# EAGLE design schematic1 (EAGLE 9.6.2)

## Sheet 1 of 4: Intelligence
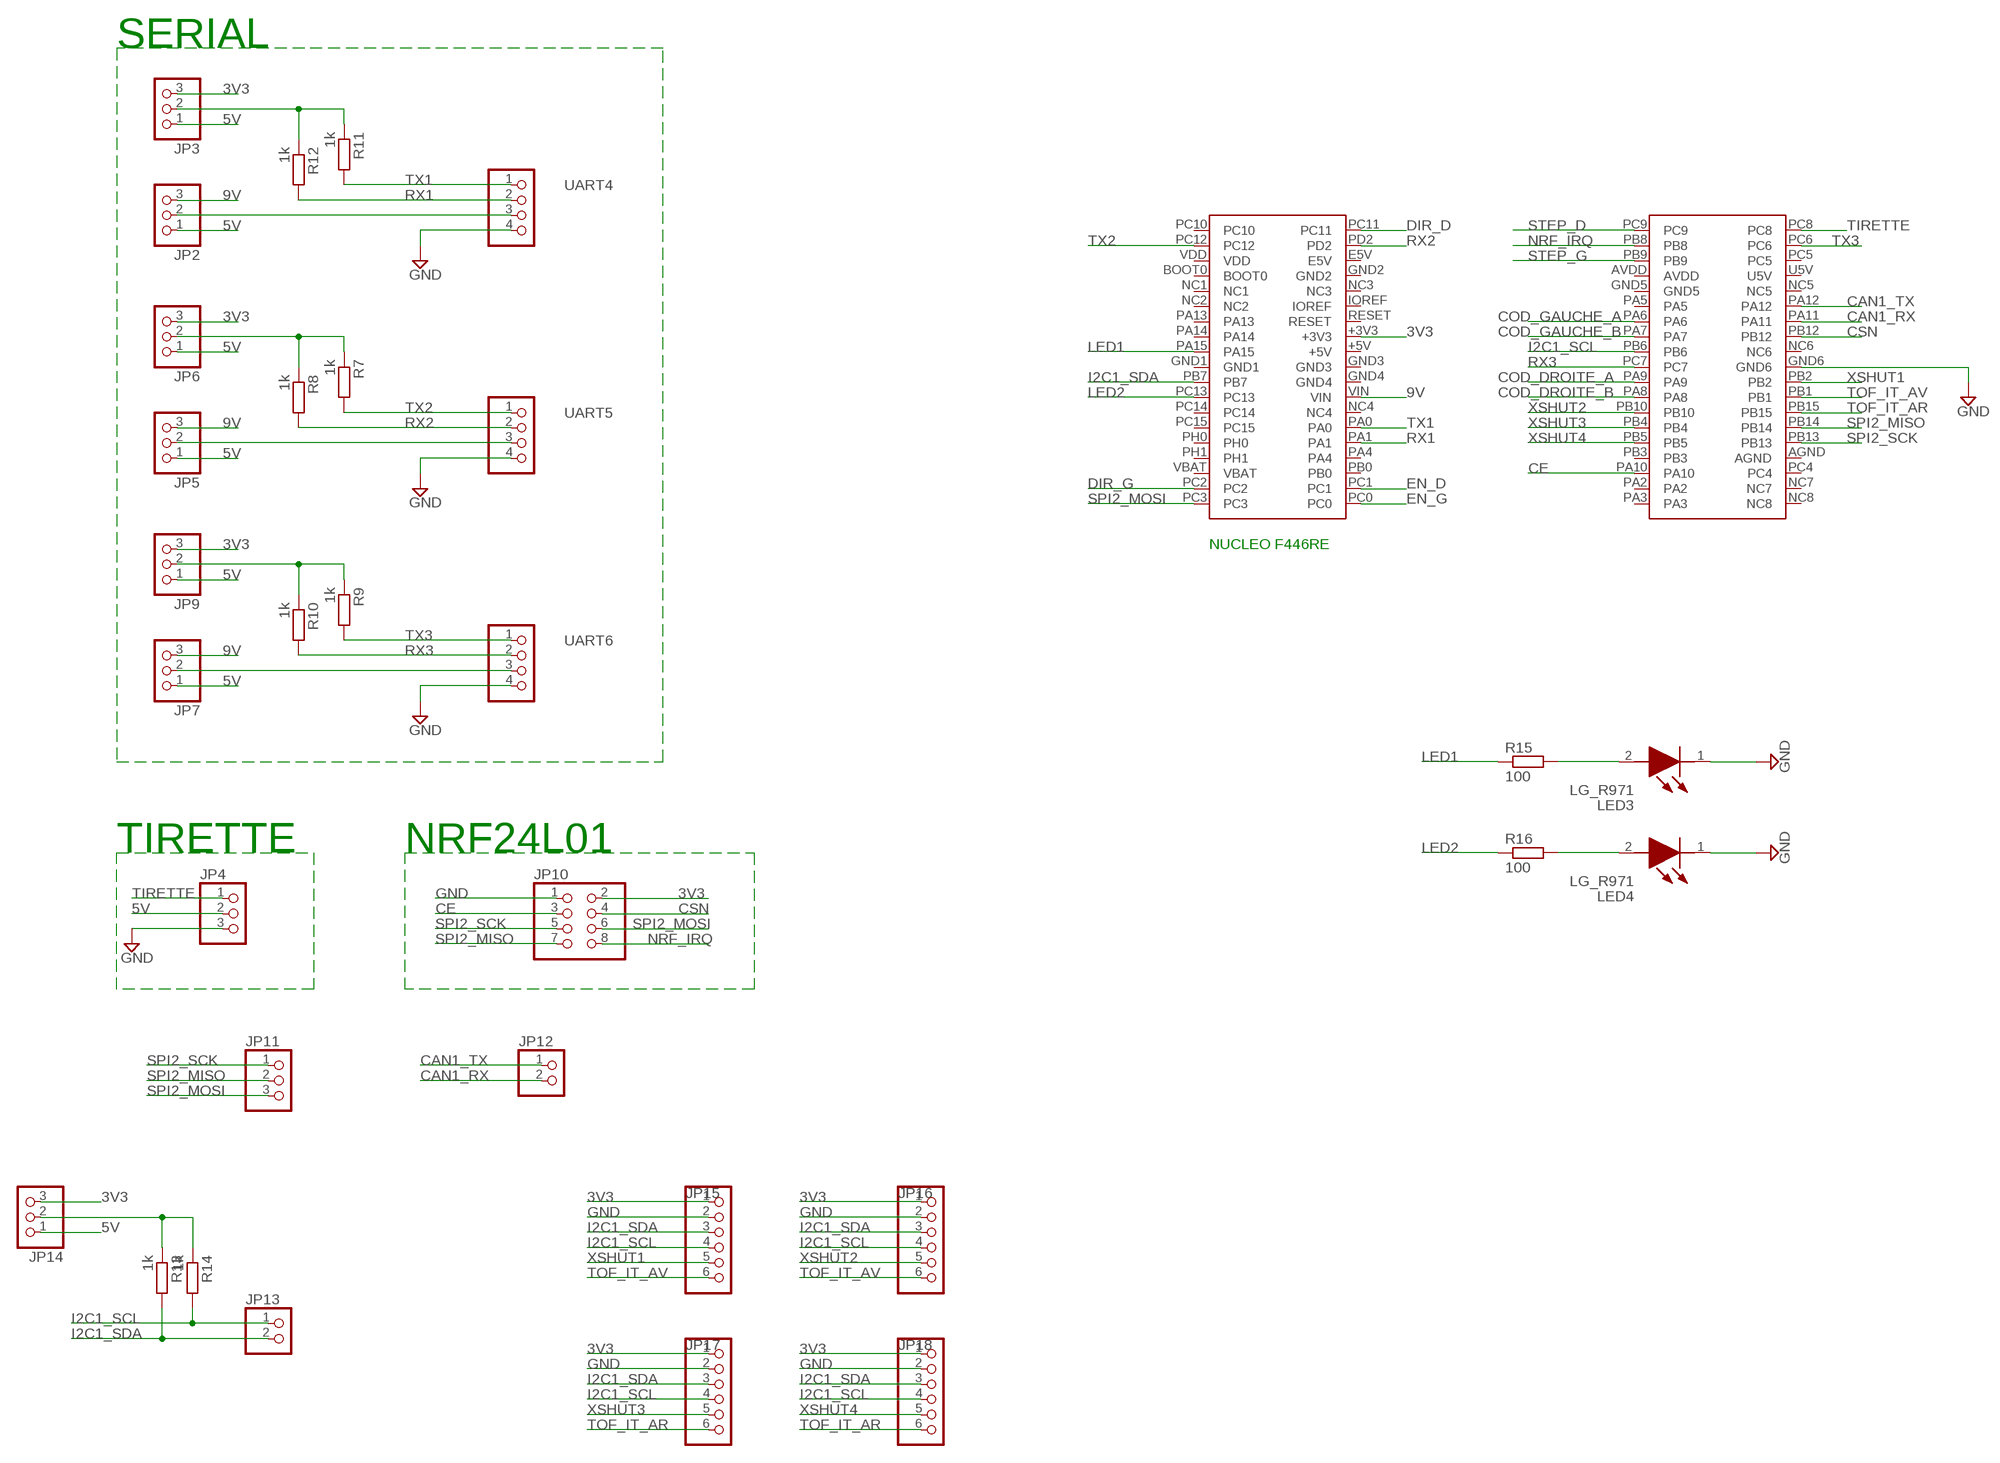
[diagram p0: schematic, sheet 1]

### Parts
JP2  PINHD-1X3  [1X03]
JP3  PINHD-1X3  [1X03]
JP4  PINHD-1X3  [1X03]
JP5  PINHD-1X3  [1X03]
JP6  PINHD-1X3  [1X03]
JP7  PINHD-1X3  [1X03]
JP9  PINHD-1X3  [1X03]
JP10  PINHD-2X4  [2X04]
JP11  PINHD-1X3  [1X03]
JP12  PINHD-1X2  [1X02]
JP13  PINHD-1X2  [1X02]
JP14  PINHD-1X3  [1X03]
JP15  PINHD-1X6  [1X06]
JP16  PINHD-1X6  [1X06]
JP17  PINHD-1X6  [1X06]
JP18  PINHD-1X6  [1X06]
LED3  LG_R971  [LEDC2012X90N]
LED4  LG_R971  [LEDC2012X90N]
R7  1k  R-EU_R0805  [R0805]
R8  1k  R-EU_R0805  [R0805]
R9  1k  R-EU_R0805  [R0805]
R10  1k  R-EU_R0805  [R0805]
R11  1k  R-EU_R0805  [R0805]
R12  1k  R-EU_R0805  [R0805]
R13  1k  R-EU_R0805  [R0805]
R14  1k  R-EU_R0805  [R0805]
R15  100  R-EU_R0805  [R0805]
R16  100  R-EU_R0805  [R0805]
U$1  NUCLEO_F446RE  [MB1136]
UART4  PINHD-1X4  [1X04]
UART5  PINHD-1X4  [1X04]
UART6  PINHD-1X4  [1X04]

### Nets
3V3: JP3.3 JP6.3 JP9.3 JP10.2 JP14.3 JP15.1 JP16.1 JP17.1 JP18.1 U$1.+3V3
5V: JP2.1 JP3.1 JP4.2 JP5.1 JP6.1 JP7.1 JP9.1 JP14.1 ; also sheet 2,3,4
9V: JP2.3 JP5.3 JP7.3 U$1.VIN ; also sheet 4
CAN1_RX: JP12.2 U$1.PA11
CAN1_TX: JP12.1 U$1.PA12
CE: JP10.3 U$1.PA10
COD_DROITE_A: U$1.PA9 ; also sheet 3
COD_DROITE_B: U$1.PA8 ; also sheet 3
COD_GAUCHE_A: U$1.PA6 ; also sheet 3
COD_GAUCHE_B: U$1.PA7 ; also sheet 3
CSN: JP10.4 U$1.PB12
DIR_D: U$1.PC11 ; also sheet 2
DIR_G: U$1.PC2 ; also sheet 2
EN_D: U$1.PC1 ; also sheet 2
EN_G: U$1.PC0 ; also sheet 2
GND: JP4.3 JP10.1 JP15.2 JP16.2 JP17.2 JP18.2 LED3.1(K) LED4.1(K) U$1.GND6 UART4.4 UART5.4 UART6.4 ; also sheet 2,3,4
I2C1_SCL: JP13.1 JP15.4 JP16.4 JP17.4 JP18.4 R14.2 U$1.PB6
I2C1_SDA: JP13.2 JP15.3 JP16.3 JP17.3 JP18.3 R13.2 U$1.PB7
LED1: R15.1 U$1.PA15
LED2: R16.1 U$1.PC13
N$3: JP3.2 R11.1 R12.1
N$4: JP6.2 R7.1 R8.1
N$10: JP9.2 R9.1 R10.1
N$14: LED3.2(A) R15.2
N$16: JP14.2 R13.1 R14.1
N$17: LED4.2(A) R16.2
NRF_IRQ: JP10.8 U$1.PB8
RX1: R12.2 U$1.PA1 UART4.2
RX2: R8.2 U$1.PD2 UART5.2
RX3: R10.2 U$1.PC7 UART6.2
SPI2_MISO: JP10.7 JP11.2 U$1.PB14
SPI2_MOSI: JP10.6 JP11.3 U$1.PC3
SPI2_SCK: JP10.5 JP11.1 U$1.PB13
STEP_D: U$1.PC9 ; also sheet 2
STEP_G: U$1.PB9 ; also sheet 2
TIRETTE: JP4.1 U$1.PC8
TOF_IT_AR: JP17.6 JP18.6 U$1.PB15
TOF_IT_AV: JP15.6 JP16.6 U$1.PB1
TX1: R11.2 U$1.PA0 UART4.1
TX2: R7.2 U$1.PC12 UART5.1
TX3: R9.2 U$1.PC6 UART6.1
VIN: JP2.2 UART4.3
VIN1: JP5.2 UART5.3
VIN2: JP7.2 UART6.3
XSHUT1: JP15.5 U$1.PB2
XSHUT2: JP16.5 U$1.PB10
XSHUT3: JP17.5 U$1.PB4
XSHUT4: JP18.5 U$1.PB5
Unconnected: U$1.+5V U$1.AGND U$1.AVDD U$1.BOOT0 U$1.E5V U$1.GND1 U$1.GND2 U$1.GND3 U$1.GND4 U$1.GND5 U$1.IOREF U$1.NC1 U$1.NC2 U$1.NC3 U$1.NC4 U$1.NC5 U$1.NC6 U$1.NC7 U$1.NC8 U$1.PA2 U$1.PA3 U$1.PA4 U$1.PA5 U$1.PA13 U$1.PA14 U$1.PB0 U$1.PB3 U$1.PC4 U$1.PC5 U$1.PC10 U$1.PC14 U$1.PC15 U$1.PH0 U$1.PH1 U$1.RESET U$1.U5V U$1.VBAT U$1.VDD

### Notes on the sheet
- SERIAL
- NUCLEO F446RE
- TIRETTE | NRF24L01

## Sheet 2 of 4: Motorisation
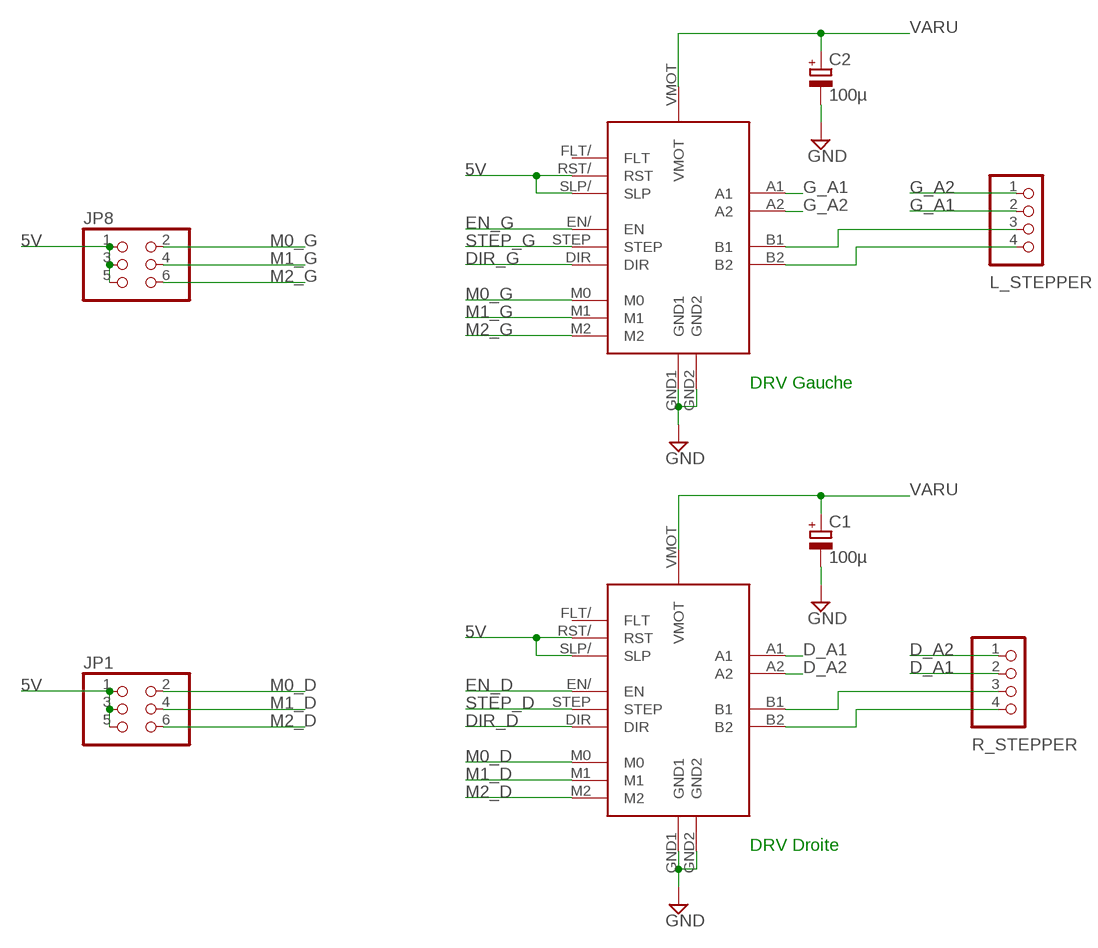
[diagram p1: schematic, sheet 2]

### Parts
C1  100µ  CPOL-EUE5-6  [E5-6]
C2  100µ  CPOL-EUE5-6  [E5-6]
JP1  PINHD-2X3  [2X03]
JP8  PINHD-2X3  [2X03]
L_STEPPER  PINHD-1X4  [1X04]
R_STEPPER  PINHD-1X4  [1X04]
U$2  POLOLU_DRV8825  [POLOLU_DRV8825]
U$3  POLOLU_DRV8825  [POLOLU_DRV8825]

### Nets
5V: JP1.1 JP1.3 JP1.5 JP8.1 JP8.3 JP8.5 U$2.RST/(RST) U$2.SLP/(SLP) U$3.RST/(RST) U$3.SLP/(SLP) ; also sheet 1,3,4
D_A1: R_STEPPER.2 U$3.A1
D_A2: R_STEPPER.1 U$3.A2
DIR_D: U$3.DIR ; also sheet 1
DIR_G: U$2.DIR ; also sheet 1
EN_D: U$3.EN/(EN) ; also sheet 1
EN_G: U$2.EN/(EN) ; also sheet 1
G_A1: L_STEPPER.2 U$2.A1
G_A2: L_STEPPER.1 U$2.A2
GND: C1.- C2.- U$2.GND1 U$2.GND2 U$3.GND1 U$3.GND2 ; also sheet 1,3,4
M0_D: JP1.2 U$3.M0
M0_G: JP8.2 U$2.M0
M1_D: JP1.4 U$3.M1
M1_G: JP8.4 U$2.M1
M2_D: JP1.6 U$3.M2
M2_G: JP8.6 U$2.M2
N$6: L_STEPPER.3 U$2.B1
N$7: L_STEPPER.4 U$2.B2
N$8: R_STEPPER.3 U$3.B1
N$9: R_STEPPER.4 U$3.B2
STEP_D: U$3.STEP ; also sheet 1
STEP_G: U$2.STEP ; also sheet 1
VARU: C1.+ C2.+ U$2.VMOT U$3.VMOT ; also sheet 4
Unconnected: U$2.FLT/(FLT) U$3.FLT/(FLT)

### Notes on the sheet
- DRV Gauche
- DRV Droite

## Sheet 3 of 4: ODOMETRIE
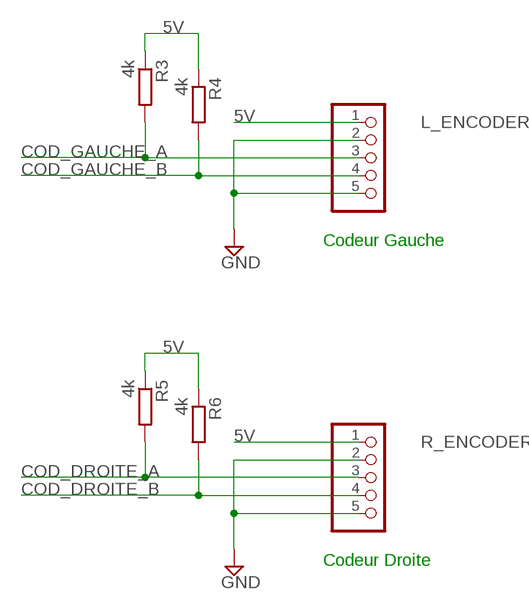
[diagram p2: schematic, sheet 3]

### Parts
L_ENCODER  PINHD-1X5  [1X05]
R3  4k  R-EU_R0805  [R0805]
R4  4k  R-EU_R0805  [R0805]
R5  4k  R-EU_R0805  [R0805]
R6  4k  R-EU_R0805  [R0805]
R_ENCODER  PINHD-1X5  [1X05]

### Nets
5V: L_ENCODER.1 R3.1 R4.1 R5.1 R6.1 R_ENCODER.1 ; also sheet 1,2,4
COD_DROITE_A: R5.2 R_ENCODER.3 ; also sheet 1
COD_DROITE_B: R6.2 R_ENCODER.4 ; also sheet 1
COD_GAUCHE_A: L_ENCODER.3 R3.2 ; also sheet 1
COD_GAUCHE_B: L_ENCODER.4 R4.2 ; also sheet 1
GND: L_ENCODER.2 L_ENCODER.5 R_ENCODER.2 R_ENCODER.5 ; also sheet 1,2,4

### Notes on the sheet
- Codeur Gauche
- Codeur Droite

## Sheet 4 of 4: ALIMENTATION
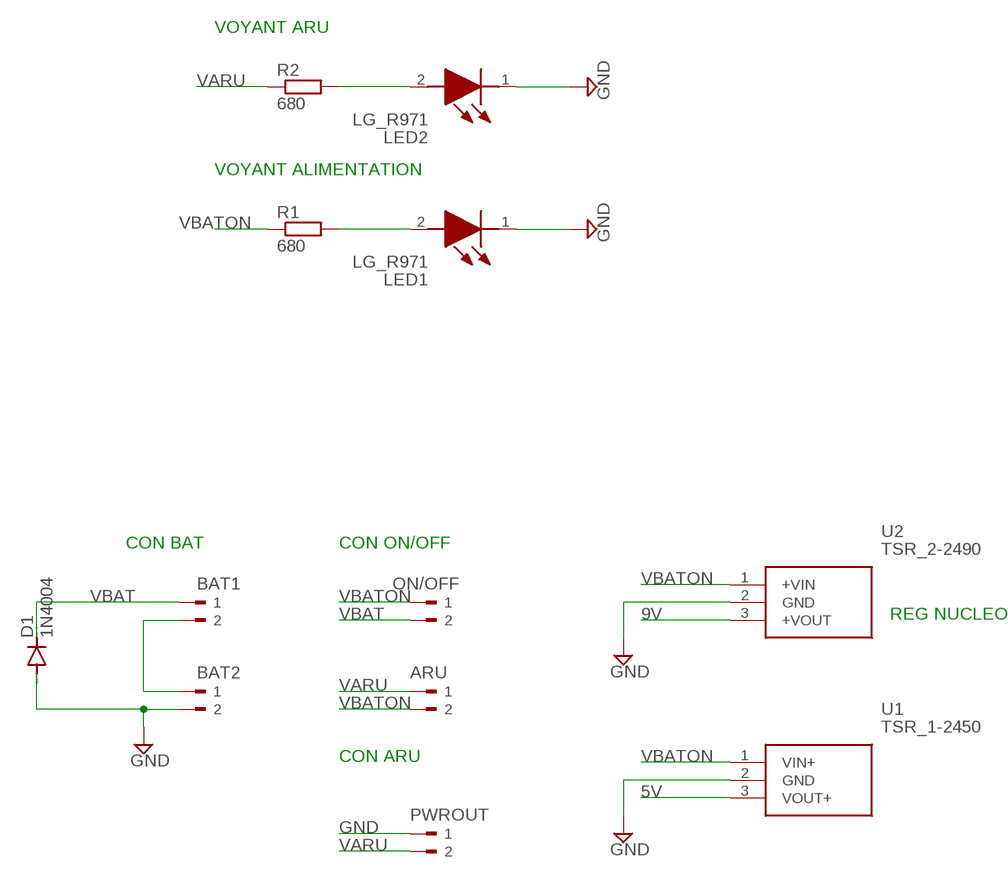
[diagram p3: schematic, sheet 4]

### Parts
ARU  180G-2  [180G-2]
BAT1  180G-2  [180G-2]
BAT2  180G-2  [180G-2]
D1  1N4004  [DO41-10]
LED1  LG_R971  [LEDC2012X90N]
LED2  LG_R971  [LEDC2012X90N]
ON/OFF  180G-2  [180G-2]
PWROUT  180G-2  [180G-2]
R1  680  R-EU_R0805  [R0805]
R2  680  R-EU_R0805  [R0805]
U1  TSR_1-2450  [TSR-1-24120]
U2  TSR_2-2490  [TSR_2-24XX]

### Nets
5V: U1.3(VOUT+) ; also sheet 1,2,3
9V: U2.3(+VOUT) ; also sheet 1
GND: BAT2.2 D1.A LED1.1(K) LED2.1(K) PWROUT.1 U1.2(GND) U2.2(GND) ; also sheet 1,2,3
N$1: LED1.2(A) R1.2
N$2: LED2.2(A) R2.2
N$5: BAT1.2 BAT2.1
VARU: ARU.1 PWROUT.2 R2.1 ; also sheet 2
VBAT: BAT1.1 D1.C ON/OFF.2
VBATON: ARU.2 ON/OFF.1 R1.1 U1.1(VIN+) U2.1(+VIN)

### Notes on the sheet
- VOYANT ARU
- VOYANT ALIMENTATION
- CON BAT | CON ON/OFF
- REG NUCLEO
- CON ARU

## Library data of the parts
ARU BAT1 BAT2 ON/OFF PWROUT = con-weidmueller-sl35:180G-2: WEIDMUELLER CLAMP CONNECTOR; OC_FARNELL: unknown; OC_NEWARK: unknown
C1 C2 = rcl:CPOL-EU: POLARIZED CAPACITOR, European symbol; SPICEPREFIX: C
D1 = diode:1N4004: DIODE general purpose rectifier, 1 A
JP1 JP8 = pinhead_modif:PINHD-2X3: PIN HEADER
JP2-JP7 JP9 JP11 JP14 = pinhead:PINHD-1X3: PIN HEADER
JP10 = pinhead:PINHD-2X4: PIN HEADER
JP12 JP13 = pinhead:PINHD-1X2: PIN HEADER
JP15-JP18 = pinhead:PINHD-1X6: PIN HEADER
L_ENCODER R_ENCODER = pinhead:PINHD-1X5: PIN HEADER
L_STEPPER R_STEPPER UART4-UART6 = pinhead:PINHD-1X4: PIN HEADER
LED1-LED4 = SamacSys_Parts:LG_R971: Green 0805 CHIPLED LG R971 Osram Opto CHIPLED 0805 Series Green LED 160 ?? 0805 Source: Datasheet <http://uk.rs-online.com/web/p/products/6545773P>; ALLIED_NUMBER: 70338572; DESCRIPTION: Green 0805 CHIPLED LG R971 Osram Opto CHIPLED 0805 Series Green LED 160 ?? 0805; HEIGHT: 0.9mm; MANUFACTURER_NAME: OSRAM; MANUFACTURER_PART_NUMBER: LG R971; RS_PART_NUMBER: 6545773P; RS_PRICE-STOCK: http://uk.rs-online.com/web/p/products/6545773P
R1-R16 = rcl:R-EU_: RESISTOR, European symbol; SPICEPREFIX: R
U1 = SamacSys_Parts:TSR_1-2450: 1 Amp POL switching regulator, 4.6 to -36 VDC input, pos.-pos. circuit, LM78 compatible, SIP-3 Source: Datasheet <http://uk.rs-online.com/web/p/products/6664379P>; DESCRIPTION: 1 Amp POL switching regulator, 4.6 to -36 VDC input, pos.-pos. circuit, LM78 compatible, SIP-3; HEIGHT: mm; MANUFACTURER_NAME: Traco Power; MANUFACTURER_PART_NUMBER: TSR 1-2450; RS_PART_NUMBER: 6664379P; RS_PRICE-STOCK: http://uk.rs-online.com/web/p/products/6664379P
U2 = Traco_Power:TSR_2-2490: Non-Isolated DC/DC Converters 12-36Vin 9V 2A SIP switching regulator Source: Datasheet <https://assets.tracopower.com/20180409093301/TSR2/documents/tsr2-datasheet.pdf>; DESCRIPTION: Non-Isolated DC/DC Converters 12-36Vin 9V 2A SIP switching regulator; HEIGHT: 10.6mm; MANUFACTURER_NAME: Traco Power; MANUFACTURER_PART_NUMBER: TSR 2-2490; MOUSER_PART_NUMBER: 495-TSR2-2490; MOUSER_PRICE-STOCK: https://www.mouser.co.uk/ProductDetail/TRACO-Power/TSR-2-2490?qs=NtE2QagKf6T%2F%252B4cKUWVBJQ%3D%3D
U$1 = NUCLEO_boards:NUCLEO_F446RE
U$2 U$3 = Pololu:POLOLU_DRV8825

## Board
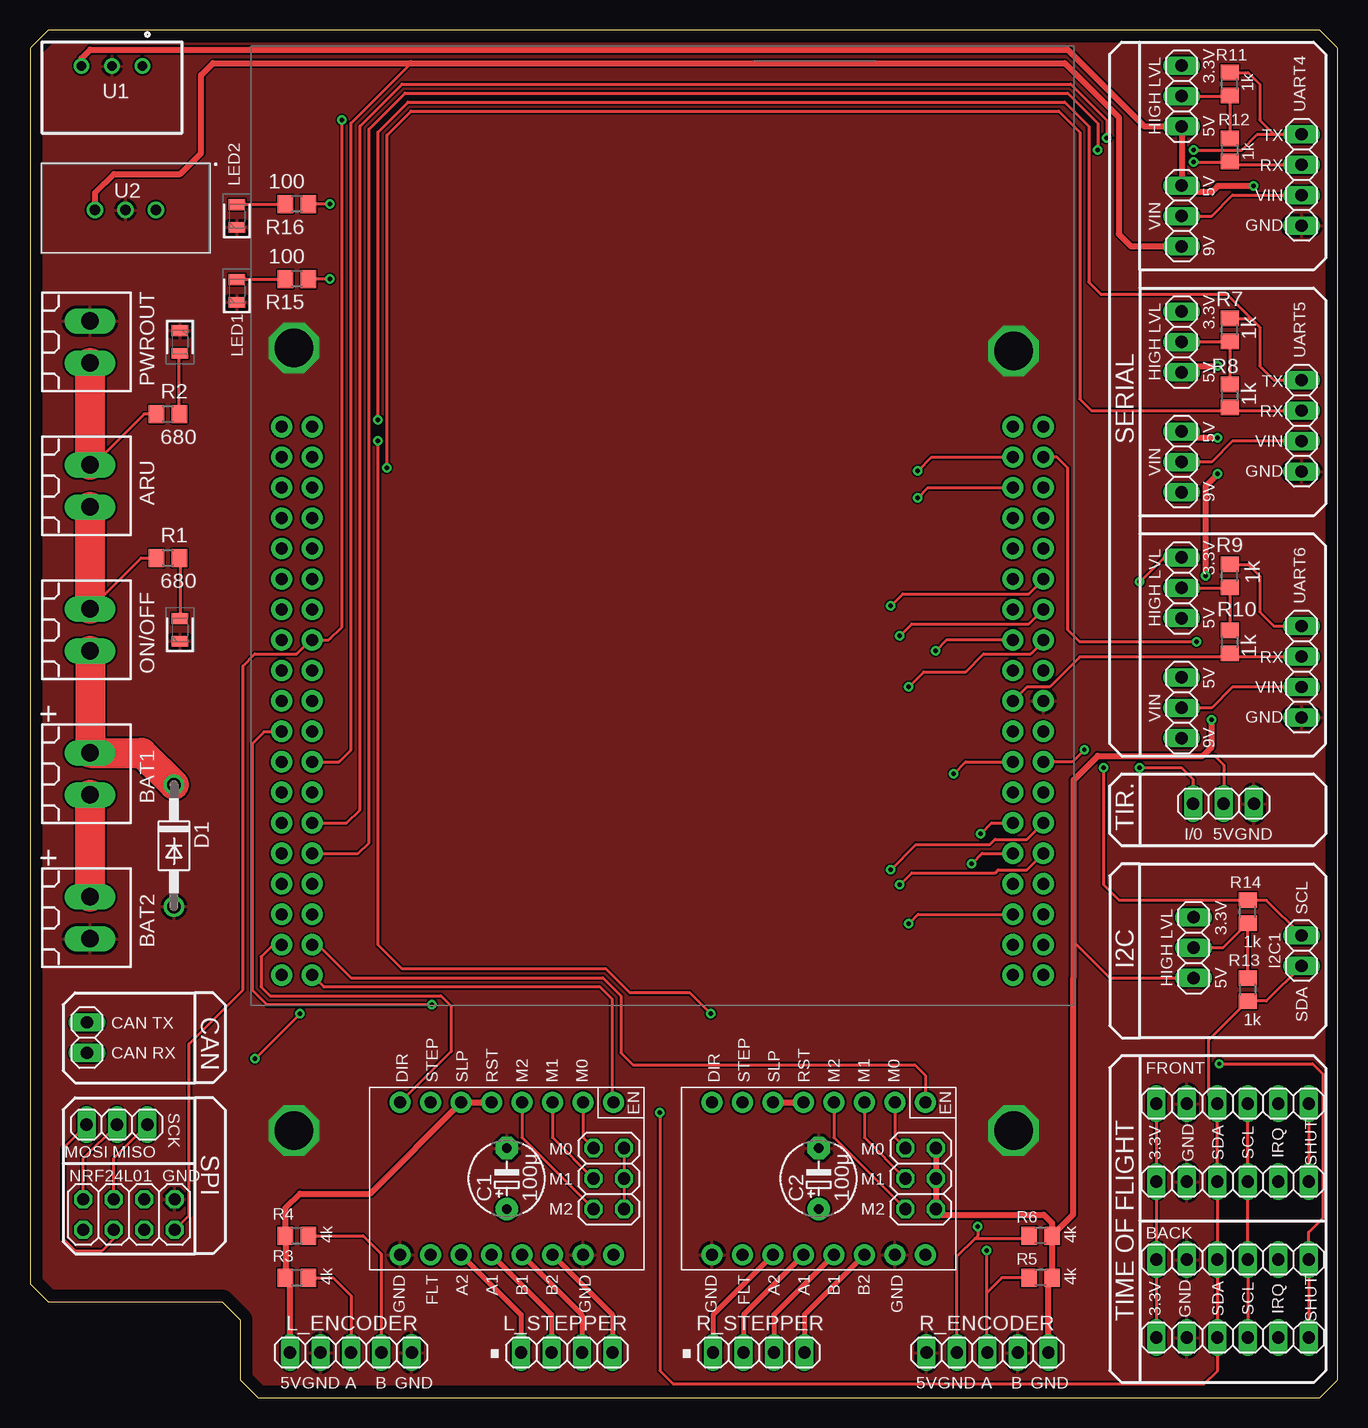
[diagram p4: board, top side]
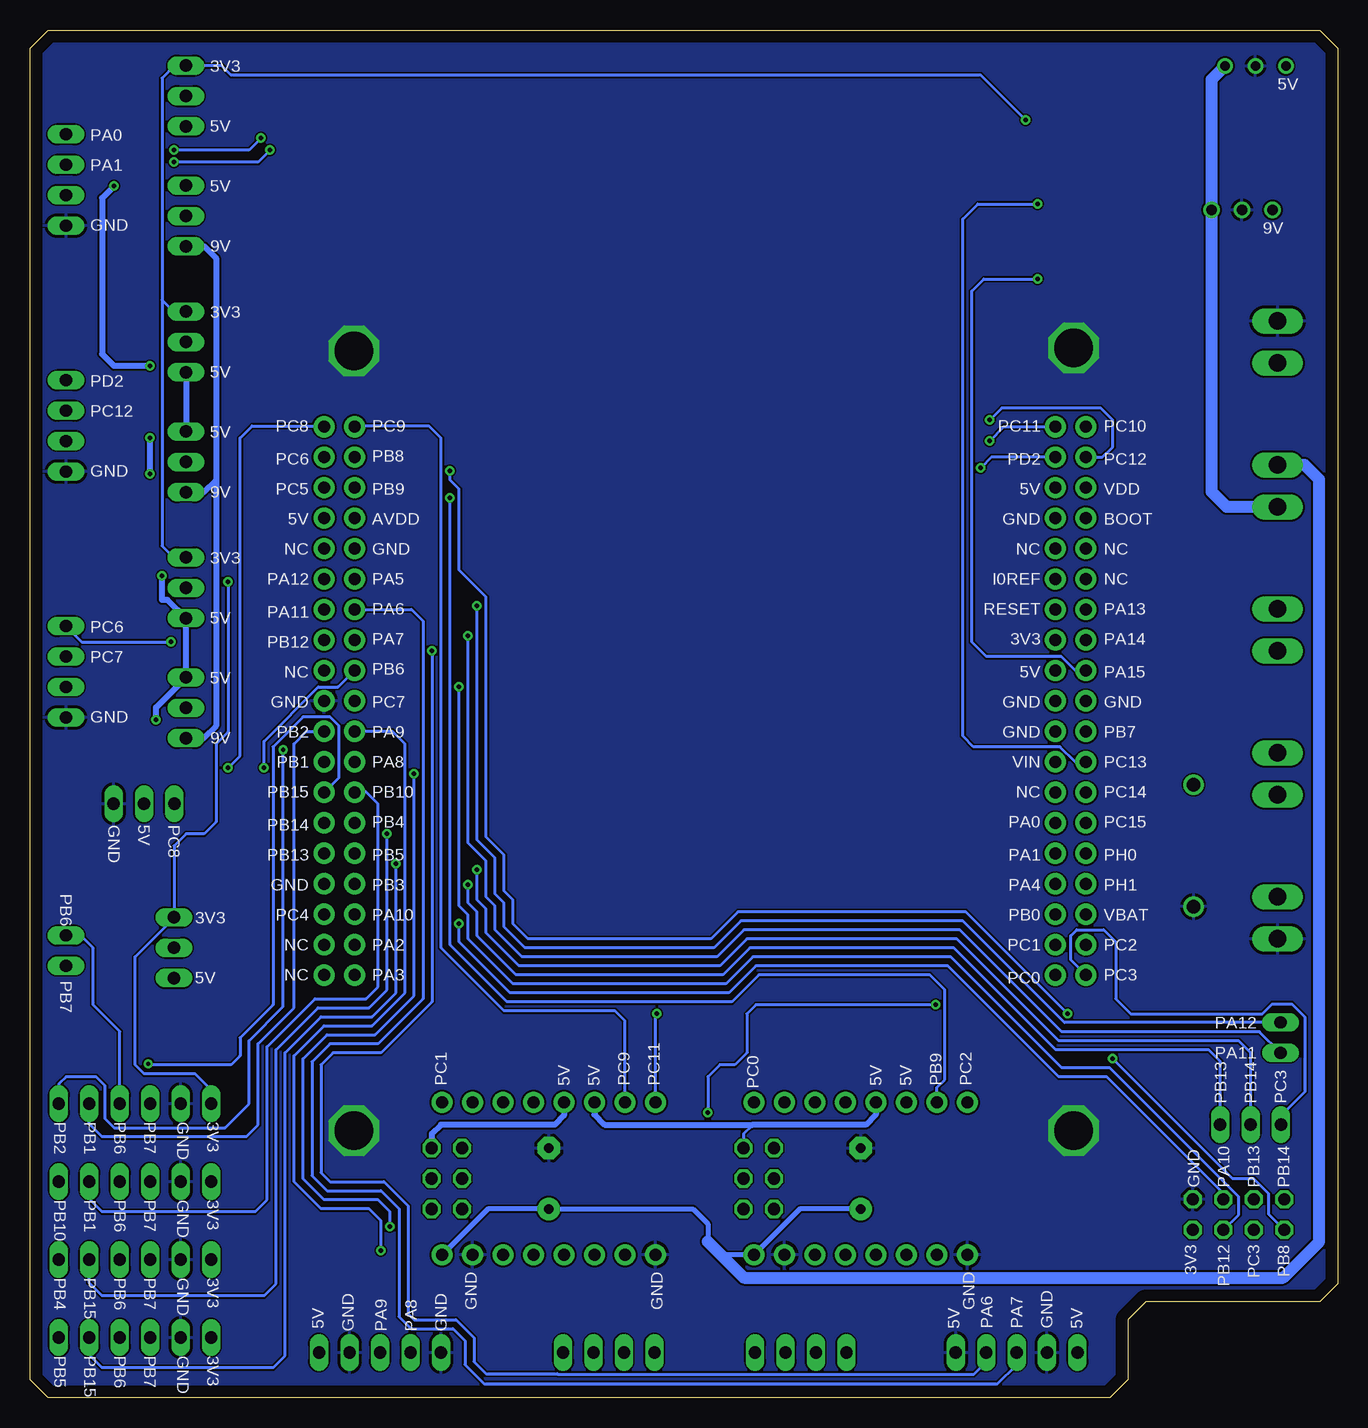
[diagram p5: board, bottom side, seen from below]

Size 109 x 114 mm. Coordinates in mm from the lower left corner, seen from the top.
Outline: 1.5,8 16,8 17.5,6.5 17.5,1.5 19,0 107.5,0 109,1.5 109,112.5 107.5,114 1.5,114 0,112.5 0,9.5 1.5,8
Copper layers (1*16): Top 0.035mm / dielectric 1.5mm / Bottom 0.035mm
Design rules "default": minimum track width 6mil, minimum drill 0.35mm, track to track 6mil, track to pad 6mil, pad to pad 6mil, via to via 6mil, smd to smd 6mil, copper to edge 40mil, drill to drill 6mil, minimum pad ring 10mil, minimum via ring 8mil, stop-mask expansion 4mil, vias tented up to drill 0mil, thermal gap 10mil

### Footprints (pad centres in the part's own frame; a part is rotated, then mirrored left to right if it is on the bottom)
180G-2 = drill 1.422 long: 1 -1.75,0; 2 1.75,0
E5-6 = drill 0.813 pad 1.905: + -2.54,0 | drill 0.813 pad 1.905 octagon: - 2.54,0
DO41-10 = drill 1.118: A 5.08,0; C -5.08,0
2X03 = drill 1.016 octagon: 1 -2.54,-1.27; 2 -2.54,1.27; 3 0,-1.27; 4 0,1.27; 5 2.54,-1.27; 6 2.54,1.27
1X03 = drill 1.016 long: 1 -2.54,0; 2 0,0; 3 2.54,0
2X04 = drill 1.016 octagon: 1 -3.81,-1.27; 2 -3.81,1.27; 3 -1.27,-1.27; 4 -1.27,1.27; 5 1.27,-1.27; 6 1.27,1.27; 7 3.81,-1.27; 8 3.81,1.27
1X02 = drill 1.016 long: 1 -1.27,0; 2 1.27,0
1X06 = drill 1.016 long: 1 -6.35,0; 2 -3.81,0; 3 -1.27,0; 4 1.27,0; 5 3.81,0; 6 6.35,0
1X05 = drill 1.016 long: 1 -5.08,0; 2 -2.54,0; 3 0,0; 4 2.54,0; 5 5.08,0
1X04 = drill 1.016 long: 1 -3.81,0; 2 -1.27,0; 3 1.27,0; 4 3.81,0
LEDC2012X90N = smd 0.9 x 1.4: 1 -0.95,0; 2 0.95,0
R0805 = smd 1.3 x 1.5: 1 -0.95,0; 2 0.95,0
TSR-1-24120 = drill 0.78 pad 1.28: 1 -2.54,0; 2 0,0; 3 2.54,0
TSR_2-24XX = drill 0.85 pad 1.381: 1 0,0; 2 2.54,0; 3 5.08,0
MB1136 = drill 1 pad 1.778: +3V3 -30.48,-6.35; +5V -30.48,-8.89; AGND 30.48,-26.67; AVDD 27.94,3.81; BOOT0 -33.02,3.81; E5V -30.48,6.35; GND1 -33.02,-11.43; GND2 -30.48,3.81; GND3 -30.48,-11.43; GND4 -30.48,-13.97; GND5 27.94,1.27; GND6 30.48,-11.43; IOREF -30.48,-1.27; NC1 -33.02,1.27; NC2 -33.02,-1.27; NC3 -30.48,1.27; NC4 -30.48,-19.05; NC5 30.48,1.27; NC6 30.48,-8.89; NC7 30.48,-31.75; NC8 30.48,-34.29; PA0 -30.48,-21.59; PA1 -30.48,-24.13; PA2 27.94,-31.75; PA3 27.94,-34.29; PA4 -30.48,-26.67; PA5 27.94,-1.27; PA6 27.94,-3.81; PA7 27.94,-6.35; PA8 27.94,-16.51; PA9 27.94,-13.97; PA10 27.94,-29.21; PA11 30.48,-3.81; PA12 30.48,-1.27; PA13 -33.02,-3.81; PA14 -33.02,-6.35; PA15 -33.02,-8.89; PB0 -30.48,-29.21; PB1 30.48,-16.51; PB2 30.48,-13.97; PB3 27.94,-26.67; PB4 27.94,-21.59; PB5 27.94,-24.13; PB6 27.94,-8.89; PB7 -33.02,-13.97; PB8 27.94,8.89; PB9 27.94,6.35; PB10 27.94,-19.05; PB12 30.48,-6.35; PB13 30.48,-24.13; PB14 30.48,-21.59; PB15 30.48,-19.05; PC0 -30.48,-34.29; PC1 -30.48,-31.75; PC2 -33.02,-31.75; PC3 -33.02,-34.29; PC4 30.48,-29.21; PC5 30.48,6.35; PC6 30.48,8.89; PC7 27.94,-11.43; PC8 30.48,11.43; PC9 27.94,11.43; PC10 -33.02,11.43; PC11 -30.48,11.43; PC12 -33.02,8.89; PC13 -33.02,-16.51; PC14 -33.02,-19.05; PC15 -33.02,-21.59; PD2 -30.48,8.89; PH0 -33.02,-24.13; PH1 -33.02,-26.67; RESET -30.48,-3.81; U5V 30.48,3.81; VBAT -33.02,-29.21; VDD -33.02,6.35; VIN -30.48,-16.51
POLOLU_DRV8825 = drill 1 pad 1.778: A1 6.35,-1.27; A2 6.35,-3.81; B1 6.35,1.27; B2 6.35,3.81; DIR -6.35,-8.89; EN/ -6.35,8.89; FLT/ 6.35,-6.35; GND1 6.35,6.35; GND2 6.35,-8.89; M0 -6.35,6.35; M1 -6.35,3.81; M2 -6.35,1.27; RST/ -6.35,-1.27; SLP/ -6.35,-3.81; STEP -6.35,-6.35; VMOT 6.35,8.89

### Placement (x,y rotation side)
ARU  5,76 270 top
BAT1  5,52 270 top
BAT2  5,40 270 top
C1  39.75,18.25 90 top
C2  65.75,18.25 90 top
D1  12,46 270 top
JP1  74.25,18.25 270 bottom
JP2  96,98.5 270 top
JP3  96,108.5 90 top
JP4  99.5,49.5 0 top
JP5  96,78 270 top
JP6  96,88 90 top
JP7  96,57.5 270 top
JP8  48.25,18.25 270 bottom
JP9  96,67.5 90 top
JP10  8.25,15.25 180 top
JP11  7.25,22.75 180 top
JP12  4.75,30 270 top
JP13  106,37.25 270 top
JP14  97,37.5 90 top
JP15  100.25,24.5 0 top
JP16  100.25,18 0 top
JP17  100.25,11.5 0 top
JP18  100.25,5 0 top
L_ENCODER  26.75,3.75 0 top
L_STEPPER  44.75,3.75 0 top
LED1  12.5,64 90 top
LED2  12.5,88 270 top
LED3  17.25,92.25 90 top
LED4  17.25,98.5 90 top
ON/OFF  5,64 270 top
PWROUT  5,88 270 top
R1  11.5,70 0 top
R2  11.5,82 0 top
R3  22.25,10 0 top
R4  22.25,13.5 0 top
R5  84.25,10 180 top
R6  84.25,13.5 180 top
R7  100,89 90 top
R8  100,83.5 270 top
R9  100,68.5 90 top
R10  100,63 270 top
R11  100,109.5 90 top
R12  100,104 270 top
R13  101.5,34 270 top
R14  101.5,40.5 90 top
R15  22.25,93.25 180 top
R16  22.25,99.5 180 top
R_ENCODER  79.82,3.75 180 top
R_STEPPER  60.75,3.75 0 top
U1  6.84,111 180 top
U2  10.5,99 180 top
U$1  54,69.5 0 top
U$2  39.75,18.25 270 top
U$3  65.75,18.25 270 top
UART4  106,101.5 270 top
UART5  106,81 270 top
UART6  106,60.5 270 top

### Tracks (layer width: path | path; a pad name or v marks a point on that pad's centre or on a via)
3V3  (via drill 0.35)
  Top 0.25: JP15.1 JP16.1 JP17.1 JP18.1 | JP9.3 95.96,70 94.5,70 v92.5,68 | v26,106.5 26,64.25 24.9,63.15 U$1.+3V3 23.38,63.15 22.21,61.98 18.73,61.98 17.75,61 17.75,34 13.25,29.5 13.25,15.17 JP10.2
  Bottom 0.25: 98,91.5 98,110 96.96,111.04 JP3.3 93.04,111.04 92.25,110.25 29.75,110.25 v26,106.5 | 98,91.5 98,71 97,70 96.04,70 JP9.3 | JP6.3 97.04,90.54 98,91.5 | v92.5,68 92.5,55.5 93.5,54.5 93.5,48 94.5,47 96,47 97,46 JP14.3 97,40 100.25,36.75 100.25,27.75 99.5,27 95.25,27 93.9,25.65 JP15.1
5V  (via drill 0.35)
  Top 0.25: JP8.1 JP8.3 JP8.5 | R3.1 21.3,10.25 21.67,9.88 | R5.1 85.2,10.25 84.9,9.95 | 97.75,53.5 98.75,53.5 99.5,52.75 JP4.2 | 87,38 90.04,34.96 JP14.1
  Top 0.508: U$2.RST/ U$2.SLP/ 28.34,17 22.5,17 21.3,15.8 R4.1 21.3,10.25 | U$3.SLP/ U$3.RST/ | JP1.1 JP1.3 JP1.5 75.98,15.25 84.5,15.25 85.2,14.55 R6.1 | v98,68.5 98,76 v99,77 | v99,80 96.54,80 JP5.1 | JP6.1 96.54,86 v99,86 | v102,101 99,101 98.5,100.5 96.54,100.5 JP2.1 JP3.1 92.9,105.96 86.5,112.36 5,112.36 4.3,111.66 U1.3 | L_ENCODER.1 21.67,9.88 | R6.1 85.2,10.25 | R_ENCODER.1 84.9,9.95 | R6.1 86.95,15.25 86.95,34.95 87,35 87,38 87,51.5 89,53.5 97.75,53.5 98.5,54.25 v98.5,56.5
  Bottom 0.25: 48.75,22.75 49.52,21.98 JP8.1
  Bottom 0.508: U$2.RST/ 38.48,23.6 39.33,22.75 48.75,22.75 61.09,22.75 61.94,23.6 U$3.SLP/ | U$3.RST/ 64.48,23.52 65.25,22.75 74.75,22.75 75.52,21.98 JP1.1 | JP6.1 JP5.1 | v98,68.5 98,66.5 97.54,66.5 JP9.1 JP7.1 98.5,57.54 v98.5,56.5 | v99,77 v99,80 | v99,86 102,86 103,87 103,100 v102,101
9V
  Top 0.25: U$1.VIN 25.77,52.99 26.75,53.97 26.75,106.25 31.75,111.25
  Top 0.5: U2.3 5.42,100.42 7,102 12.5,102 14.25,103.75 14.25,110.25 15.25,111.25 31.75,111.25 86.25,111.25 90.75,106.75 90.75,97 91.79,95.96 JP2.3
  Bottom 0.25: 94.54,75.46 JP5.3 | 94.54,54.96 JP7.3
  Bottom 0.508: JP2.3 94.46,95.96 93.5,95 93.5,76.5 | 93.5,76.5 94.54,75.46 | 93.5,76.5 93.5,56 94.54,54.96
CAN1_RX  (via drill 0.35)
  Top 0.25: v72.5,63.5 73.5,64.5 83.25,64.5 84.44,65.69 U$1.PA11
  Bottom 0.25: JP12.2 6.52,30.5 23,30.5 31.5,39 49.5,39 51.75,36.75 68,36.75 70.25,39 70.25,41 71,41.75 71,44.75 72.5,46.25 v72.5,63.5
CAN1_TX  (via drill 0.35)
  Top 0.25: v71.75,66 72.75,67 83.25,67 U$1.PA12
  Bottom 0.25: JP12.1 22.77,31.27 31.25,39.75 49.75,39.75 52,37.5 67.75,37.5 69.5,39.25 69.5,41.25 70.25,42 70.25,45 71.75,46.5 v71.75,66
CE  (via drill 0.35)
  Top 0.25: v73.25,39.5 74.04,40.29 U$1.PA10
  Bottom 0.25: JP10.3 9.52,17.02 19.25,26.75 23.25,26.75 32.5,36 48.5,36 50.75,33.75 69,33.75 73.25,38 v73.25,39.5
COD_DROITE_A  (via drill 0.35)
  Top 0.25: 79.75,8.75 81,10 R5.2 | 79.75,8.75 79.75,3.82 R_ENCODER.3 | 79.75,8.75 v79.75,12.25
  Bottom 0.25: v79.75,12.25 79.75,14.75 80.75,15.75 84.75,15.75 87,18 87,28.5 84.5,31 80.5,31 77.75,33.75 77.75,54.5 78.78,55.53 U$1.PA9
COD_DROITE_B  (via drill 0.35)
  Top 0.25: R_ENCODER.4 77.28,11.78 78.75,13.25 | 78.75,13.25 83.05,13.25 R6.2 | v79,14.25 79,13.5 78.75,13.25 | U$1.PA8 77.99,52.99 v77,52
  Bottom 0.25: v77,52 77,33.5 80.25,30.25 84.25,30.25 86.25,28.25 86.25,18.25 84.5,16.5 80,16.5 79,15.5 v79,14.25
COD_GAUCHE_A
  Top 0.25: R3.2 25.25,10 26.75,8.5 L_ENCODER.3
  Bottom 0.25: U$1.PA6 77.19,65.69 76.25,64.75 76.25,33.25 80,29.5 84,29.5 85.5,28 85.5,18.5 84.25,17.25 79.75,17.25 78.25,15.75 78.25,6.75 77.25,5.75 73.75,5.75 72.75,4.75 72.75,2.75 71.14,1.14 28.36,1.14 26.75,2.75 L_ENCODER.3
COD_GAUCHE_B  (via drill 0.35)
  Top 0.25: R4.2 27.75,13.5 29.29,11.96 L_ENCODER.4 | U$1.PA7 76.4,63.15 v75.5,62.25
  Bottom 0.25: v75.5,62.25 75.5,33 79.75,28.75 83.75,28.75 84.75,27.75 84.75,18.75 84,18 79.5,18 77.5,16 77.5,7 77,6.5 73.5,6.5 72,5 72,3 71,2 65.04,2 64.99,1.95 30.3,1.95 29.25,3 29.25,3.71 L_ENCODER.4
CSN  (via drill 0.35)
  Top 0.25: v73.25,59.25 74.5,60.5 78,60.5 79.48,61.98 83.42,61.98 84.48,63.04 U$1.PB12
  Bottom 0.25: JP10.4 8.25,15.25 8.25,16.75 19,27.5 23,27.5 32.25,36.75 48.75,36.75 51,34.5 68.75,34.5 72.5,38.25 72.5,40.25 73.25,41 v73.25,59.25
D_A1
  Top 0.406: U$3.A1 59.48,6.9 R_STEPPER.2
D_A2
  Top 0.406: U$3.A2 56.94,6.9 R_STEPPER.1
DIR_D  (via drill 0.35)
  Top 0.25: v56.75,32 55,33.75 50,33.75 48,35.75 31,35.75 29,37.75 v29,79.75
  Bottom 0.25: U$3.DIR 56.86,31.89 v56.75,32 | v29,79.75 27.82,80.93 U$1.PC11
DIR_G
  Top 0.25: U$1.PC2 20.25,37.75 19.25,36.75 19.25,34.25 20,33.5 34.25,33.5 35.11,32.64 35.11,28.85 U$2.DIR
EN_D
  Top 0.25: U$1.PC1 24,37.75 26.75,35 47.75,35 49.25,33.5 49.25,28.75 50.25,27.75 73.75,27.75 74.64,26.86 U$3.EN/
EN_G
  Top 0.25: U$1.PC0 24.52,34.21 47.54,34.21 48.5,33.25 48.5,24.74 U$2.EN/
G_A1
  Top 0.406: U$2.A1 43.48,6.9 L_STEPPER.2
G_A2
  Top 0.406: U$2.A2 40.94,6.9 L_STEPPER.1
GND  (via drill 3.2)
  other vias: 22,87.5 82,87.25 22,22.25 82,22.25
  pour Top: -3,115.75 -3,-3 111.25,-3 111.25,115.75
  pour Bottom: -3.75,-4.5 -3.75,116.5 112.75,116.5 112.75,-4.5
I2C1_SCL  (via drill 0.35)
  Top 0.25: JP13.1 103.07,41.45 R14.2 90.8,41.45 89.5,42.75 v89.5,52.5 | JP18.4 JP17.4 JP16.4 JP15.4
  Bottom 0.25: JP15.4 101.52,30.52 103.75,32.75 103.75,37.5 104.77,38.52 JP13.1 | U$1.PB6 83.31,59.24 84.96,59.24 89.5,54.7 v89.5,52.5
I2C1_SDA  (via drill 0.35)
  Top 0.25: JP13.2 103.07,33.05 R13.2 98.23,29.78 98.23,25.25 JP15.3 JP16.3 JP17.3 JP18.3 99,4.98 99,2.25 97.89,1.14 53.61,1.14 52.5,2.25 v52.5,23.75 | U$1.PB7 20.95,55.5 19.5,55.5 18.5,54.5 18.5,34 19.75,32.75 v33.5,32.75
  Bottom 0.25: v33.5,32.75 48.5,32.75 49.25,32 49.25,28.75 50.25,27.75 51.5,27.75 52.5,26.75 v52.5,23.75
LED1  (via drill 0.35)
  Top 0.25: v25,93.25 R15.1
  Bottom 0.25: U$1.PA15 21.87,60.61 23.04,61.78 29.28,61.78 30.5,63 30.5,92.25 29.5,93.25 v25,93.25
LED2  (via drill 0.35)
  Top 0.25: v25,99.5 R16.1
  Bottom 0.25: U$1.PC13 21.87,52.99 23.13,54.25 30.34,54.25 31.25,55.16 31.25,98.25 30,99.5 v25,99.5
M0_D
  Top 0.25: U$3.M0 72.1,21.67 JP1.2
M0_G
  Top 0.25: U$2.M0 46.1,21.67 JP8.2
M1_D
  Top 0.25: U$3.M1 69.56,21.67 JP1.4
M1_G
  Top 0.25: U$2.M1 43.56,21.67 JP8.4
M2_D
  Top 0.25: U$3.M2 67.02,21.67 JP1.6
M2_G
  Top 0.25: U$2.M2 41.02,21.67 JP8.6
N$1
  Top 0.2: R1.2 12.5,69.95
  Top 0.25: 12.5,69.95 LED1.2
N$2
  Top 0.2: 12.45,87 LED2.2
  Top 0.25: R2.2 12.45,87
N$3
  Top 0.2: 99.95,108.5 R11.1
  Top 0.25: JP3.2 99.95,108.5 | R11.1 R12.1
N$4
  Top 0.25: JP6.2 99.95,88 R7.1 R8.1
N$5
  Top 2.5: BAT2.1 BAT1.2
N$6
  Top 0.406: U$2.B1 46.02,6.9 L_STEPPER.3
N$7
  Top 0.406: U$2.B2 48.56,6.9 L_STEPPER.4
N$8
  Top 0.406: U$3.B1 62.02,6.9 R_STEPPER.3
N$9
  Top 0.406: U$3.B2 64.56,6.9 R_STEPPER.4
N$10
  Top 0.25: JP9.2 99.95,67.5 R9.1 R10.1
N$14
  Top 0.25: R15.2 21.25,93.2 LED3.2
N$16
  Top 0.25: R13.1 R14.1 99.45,37.5 JP14.2
N$17
  Top 0.25: R16.2 21.25,99.45 LED4.2
NRF_IRQ  (via drill 0.35)
  Top 0.25: v18.75,28.25 v22.5,32 | v74,77.25 75.14,78.39 U$1.PB8
  Bottom 0.25: JP10.8 5.75,15.29 5.75,17 7,18.25 8.75,18.25 v18.75,28.25 | v22.5,32 31,40.5 50,40.5 52.25,38.25 67.5,38.25 68.75,39.5 68.75,41.5 69.5,42.25 69.5,45.25 71,46.75 71,66.75 73.25,69 73.25,75.75 74,76.5 v74,77.25
RX1  (via drill 0.35)
  Top 0.2: 100.28,102.77 100.03,103.03 R12.2
  Top 0.25: 100.28,102.77 UART4.2 | U$1.PA1 27.37,45.37 28.25,46.25 28.25,105.75 31.25,108.75 86.5,108.75 89,106.25 v89,104 | v97,103 100,103 100.03,103.03
  Bottom 0.25: v89,104 90,103 v97,103
RX2  (via drill 0.35)
  Top 0.25: R8.2 100.28,82.27 | 100.28,82.27 UART5.2 | v29.75,77.5 29.75,105.25 31.75,107.25 85.75,107.25 87.5,105.5 87.5,83.25 88.48,82.27 100.28,82.27
  Bottom 0.25: U$1.PD2 28.86,78.39 v29.75,77.5
RX3
  Top 0.25: UART6.2 100.28,61.77 R10.2 99.7,61.75 87.5,61.75 85,59.25 83.12,59.25 U$1.PC7
SPI2_MISO  (via drill 0.35)
  Top 0.25: JP10.7 4.44,19.94 JP11.2 | v71.75,44 73.84,46.09 80.02,46.09 80.46,46.54 83.11,46.54 U$1.PB14
  Bottom 0.25: JP11.2 7.25,28.75 8.25,29.75 23.25,29.75 31.75,38.25 49.25,38.25 51.5,36 68.25,36 71,38.75 71,40.75 71.75,41.5 v71.75,44
SPI2_MOSI
  Top 0.25: JP11.3 2.75,20.79 2.75,13.25 3.75,12.25 6,12.25 6.98,13.23 JP10.6
  Bottom 0.25: U$1.PC3 22.25,36.48 22.25,38.5 21.75,39 19.5,39 18.5,38 18.5,33.25 17.25,32 6.25,32 5.44,32.81 3.81,32.81 2.75,31.75 2.75,25.46 4.71,23.5 JP11.3
SPI2_SCK  (via drill 0.35)
  Top 0.25: JP10.5 6.98,19.94 JP11.1 | v72.5,42.75 73.5,43.75 80.46,43.75 80.71,44 83.11,44 U$1.PB13
  Bottom 0.25: JP11.1 9.79,28.04 10.75,29 23.5,29 32,37.5 49,37.5 51.25,35.25 68.5,35.25 71.75,38.5 71.75,40.5 72.5,41.25 v72.5,42.75
STEP_D
  Bottom 0.25: U$3.STEP 59.4,31.4 60.25,32.25 69.5,32.25 74.75,37.5 74.75,80 75.75,81 81.87,81 U$1.PC9
STEP_G  (via drill 0.35)
  Top 0.25: v74,75 74.85,75.85 U$1.PB9
  Bottom 0.25: U$2.STEP 33.4,25.85 32.75,26.5 32.75,34 34,35.25 48.25,35.25 50.5,33 69.25,33 74,37.75 v74,75
TIRETTE  (via drill 0.35)
  Top 0.25: JP4.1 96.96,51.54 96,52.5 v92.5,52.5
  Bottom 0.25: v92.5,52.5 91.5,53.5 91.5,80 90.5,81 84.55,81 U$1.PC8
TOF_IT_AR  (via drill 0.35)
  Top 0.25: v99.14,27.81 106.94,27.81 107.75,27 107.75,14.94 106.6,13.79 JP17.6 JP18.6
  Bottom 0.25: U$1.PB15 83.25,51.68 83.25,56 84,56.75 86.25,56.75 88.75,54.25 88.75,32.75 91.5,30 91.5,28.5 92.25,27.75 99.14,27.75 v99.14,27.81
TOF_IT_AV  (via drill 0.35)
  Top 0.25: v87.91,54 86.9,52.99 U$1.PB1 | JP15.6 JP16.6
  Bottom 0.25: v87.91,54 87.91,32.59 90.75,29.75 90.75,24.5 92.75,22.5 102,22.5 102.75,23.25 102.75,26 103.5,26.75 106,26.75 106.6,26.15 JP15.6
TX1  (via drill 0.35)
  Top 0.25: R11.2 101.55,110.45 102.5,109.5 102.5,106.5 103.69,105.31 | 103.69,105.31 UART4.1 | U$1.PA0 26.41,47.91 27.5,49 27.5,106 31,109.5 86.75,109.5 89.75,106.5 v89.75,105 | v97,104 101,104 102.31,105.31 103.69,105.31
  Bottom 0.25: v89.75,105 90.75,104 v97,104
TX2  (via drill 0.35)
  Top 0.25: R7.2 101.8,89.95 | 101.8,89.95 102.5,89.25 102.5,86 103.69,84.81 UART5.1 | v29,81.5 29,105.5 31.5,108 86.25,108 88.25,106 88.25,93 89.25,92 99.75,92 101.8,89.95
  Bottom 0.25: U$1.PC12 19.61,78.39 18.75,79.25 18.75,81.5 19.75,82.5 28,82.5 v29,81.5
TX3  (via drill 0.35)
  Top 0.25: R9.2 101.55,69.45 102.5,68.5 102.5,65.5 103.69,64.31 UART6.1 | v97.25,63 87.5,63 86.5,64 86.5,77.5 85.61,78.39 U$1.PC6
  Bottom 0.25: UART6.1 104.69,63 v97.25,63
VARU
  Top 0.2: 5.25,77.75 ARU.1
  Top 0.25: R2.1 9.5,82 5.25,77.75
  Top 2.5: ARU.1 PWROUT.2
  Bottom 0.406: C1.+ 44.83,15.71 U$2.VMOT 51.4,11.9 52.5,13 52.5,14.46 53.75,15.71 C2.+ 70.83,15.71 U$3.VMOT
  Bottom 1.016: 52.5,13 49.5,10 4.52,10 1.52,13 1.52,76.52 2.75,77.75 ARU.1
VBAT
  Top 2.5: D1.C 9.33,53.75 BAT1.1 ON/OFF.2
VBATON
  Top 0.25: ON/OFF.1 9.25,70 R1.1
  Top 2.5: ON/OFF.1 ARU.2
  Bottom 1.016: ARU.2 9.25,74.25 10.5,75.5 U2.1 10.5,109.88 U1.1
VIN
  Top 0.25: JP2.2 98.5,98.5 100.23,100.23 UART4.3
VIN1
  Top 0.25: UART5.3 100.23,79.73 98.5,78 JP5.2
VIN2
  Top 0.25: UART6.3 100.23,59.23 98.5,57.5 JP7.2
XSHUT1
  Bottom 0.25: U$1.PB2 85.97,55.53 87,54.5 87,32.5 90,29.5 90,22.75 91,21.75 103,21.75 104.06,22.81 JP15.5
XSHUT2
  Bottom 0.25: U$1.PB10 81.89,50.5 81,50.5 80,49.5 80,34.25 81,33.25 85.25,33.25 89.25,29.25 89.25,16.5 90.25,15.5 103,15.5 104.06,16.56 JP16.5
XSHUT3  (via drill 0.35)
  Top 0.25: v79.25,47 80.16,47.91 U$1.PB4
  Bottom 0.25: v79.25,47 79.25,34 80.75,32.5 85,32.5 88.5,29 88.5,9.5 89.5,8.5 103,8.5 104.06,9.56 JP17.5
XSHUT4  (via drill 0.35)
  Top 0.25: U$1.PB5 79.37,45.37 v78.5,44.5
  Bottom 0.25: v78.5,44.5 78.5,33.75 80.5,31.75 84.75,31.75 87.75,28.75 87.75,3.5 88.75,2.5 103,2.5 104.06,3.56 JP18.5

### Text on the board
tPlace: 3.3V | HIGH LVL | 5V | TX | RX | LED2 | 5V | U2 | VIN | VIN | GND | 9V | 3.3V | HIGH LVL | LED1 | 5V | TX | RX | 5V | VIN | SERIAL | VIN | GND | 9V | 3.3V | HIGH LVL | 5V | RX | 5V | VIN | + | VIN | GND | 9V | TIR. | I/0 | 5V | GND | + | 3.3V | SCL | HIGH LVL | I2C1 | I2C | 5V | SDA | CAN | CAN TX | CAN RX | FRONT | DIR | STEP | SLP | RST | M2 | M1 | M0 | DIR | STEP | SLP | RST | M2 | M1 | M0 | SCK | MOSI | MISO | M0 | M0 | 3.3V | GND | SDA | SCL | IRQ | SHUT | SPI | NRF24L01 | GND | M1 | M1 | M2 | M2 | TIME OF FLIGHT | BACK | GND | FLT | A2 | A1 | B1 | B2 | GND | GND | FLT | A2 | A1 | B1 | B2 | GND | 3.3V | GND | SDA | SCL | IRQ | SHUT | . | . | 5V | GND | A | B | GND | 5V | GND | A | B | GND
bPlace: 3V3 | 5V | 5V | PA0 | PA1 | 5V | 9V | GND | 9V | 3V3 | 5V | PD2 | PC12 | PC10 | PC11 | PC9 | PC8 | 5V | PC12 | PD2 | PB8 | PC6 | GND | VDD | 5V | PB9 | PC5 | 9V | BOOT | GND | AVDD | 5V | NC | NC | GND | NC | 3V3 | NC | I0REF | PA5 | PA12 | PA13 | RESET | PA6 | PA11 | 5V | PC6 | PA14 | 3V3 | PA7 | PB12 | PC7 | PA15 | 5V | PB6 | NC | 5V | GND | GND | PC7 | GND | GND | PB7 | GND | PA9 | PB2 | 9V | PC13 | VIN | PA8 | PB1 | PC14 | NC | PB10 | PB15 | PC8 | 5V | GND | PC15 | PA0 | PB4 | PB14 | PH0 | PA1 | PB5 | PB13 | PH1 | PA4 | PB3 | GND | PB6 | VBAT | PB0 | PA10 | PC4 | 3V3 | PC2 | PC1 | PA2 | NC | PC3 | PC0 | PA3 | NC | 5V | PB7 | PA12 | PA11 | PC2 | PB9 | 5V | 5V | PC0 | PC11 | PC9 | 5V | 5V | PC1 | PC3 | PB14 | PB13 | 3V3 | GND | PB7 | PB6 | PB1 | PB2 | PB14 | PB13 | PA10 | GND | 3V3 | GND | PB7 | PB6 | PB1 | PB10 | PB8 | PC3 | PB12 | 3V3 | GND | GND | GND | 3V3 | GND | PB7 | PB6 | PB15 | PB4 | 5V | GND | PA7 | PA6 | 5V | 5V | GND | PA8 | PA9 | GND | 3V3 | GND | PB7 | PB6 | PB15 | PB5